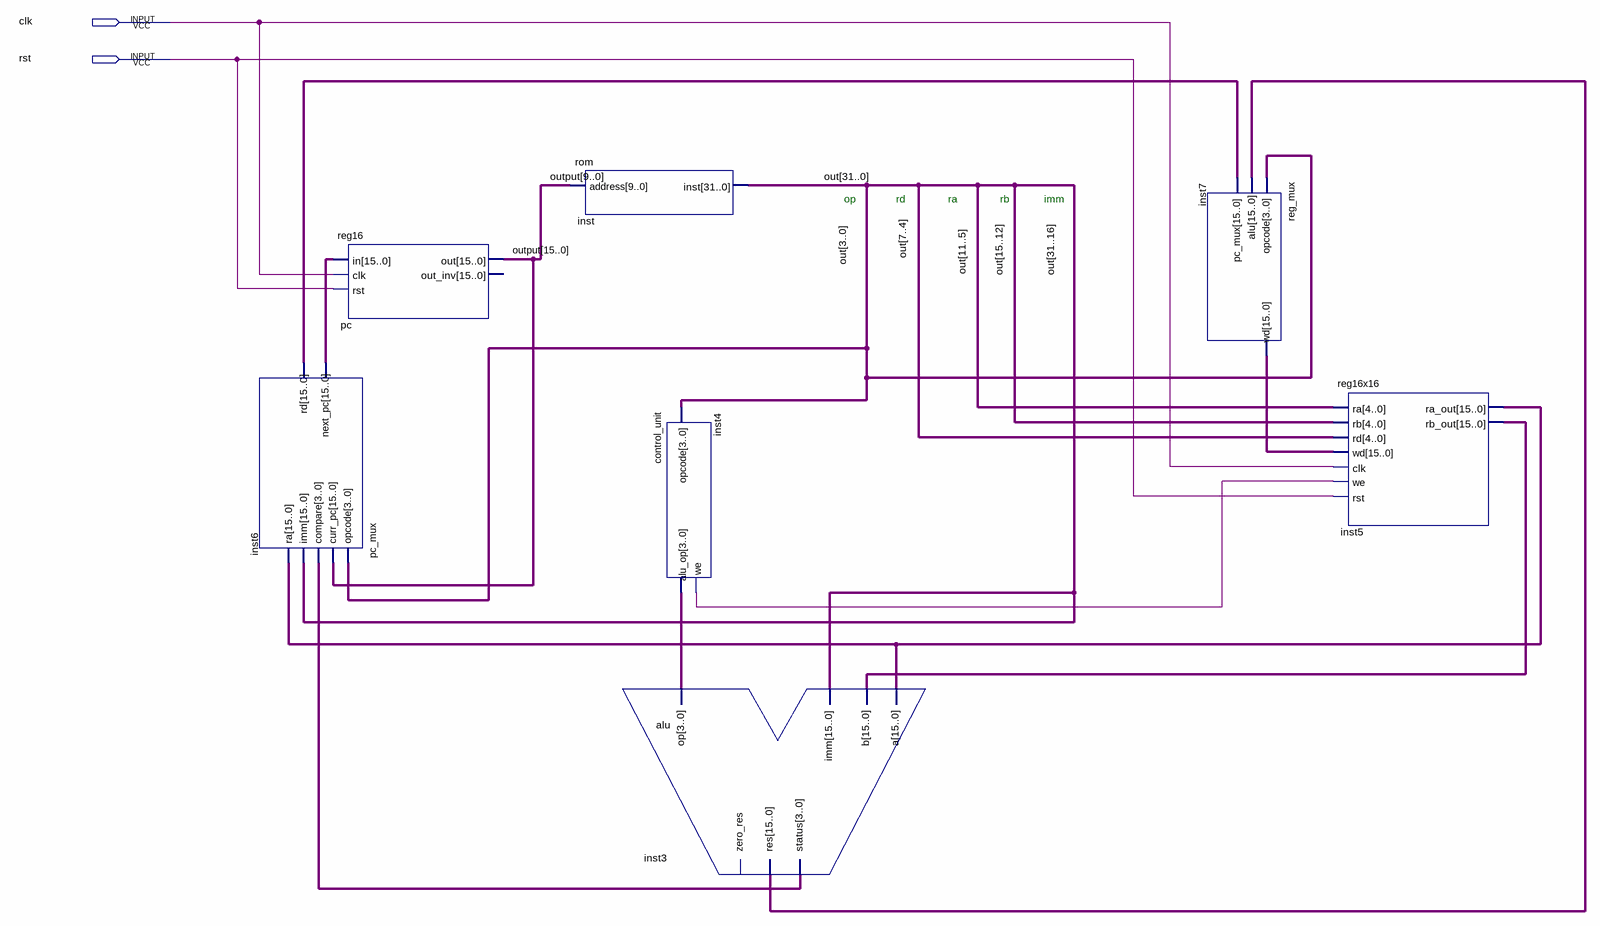
[diagram p0: schematic sheet]
// Quartus schematic zepto-processor-v.bdf as structural Verilog: 7 symbols, 2 pins
module \zepto-processor-v  (
  input  clk,
  input  rst
);

  wire inst4_we;
  wire [3:0] inst3_status, inst4_alu_op;
  wire [15:0] inst3_res, inst5_ra_out, inst5_rb_out, inst6_next_pc, inst6_rd, inst7_wd, \output ;
  wire [31:0] out;

  pc_mux inst6 (
    .opcode(out[3:0]), .curr_pc(\output ), .compare(inst3_status), .imm(out[31:16]), .ra(inst5_ra_out),
    .next_pc(inst6_next_pc), .rd(inst6_rd));
  reg16 pc (.in(inst6_next_pc), .clk(clk), .rst(rst), .out(\output ));  // open: out_inv
  rom inst (.address(\output [9:0]), .inst(out));
  control_unit inst4 (.opcode(out[3:0]), .alu_op(inst4_alu_op), .we(inst4_we));
  alu inst3 (
    .a(inst5_ra_out), .b(inst5_rb_out), .imm(out[31:16]), .op(inst4_alu_op), .res(inst3_res),
    .status(inst3_status));  // open: zero_res
  reg_mux inst7 (.opcode(out[3:0]), .alu(inst3_res), .pc_mux(inst6_rd), .wd(inst7_wd));
  reg16x16 inst5 (
    .ra(out[11:5]), .rb(out[15:12]), .rd(out[7:4]), .wd(inst7_wd), .clk(clk), .we(inst4_we), .rst(rst),
    .ra_out(inst5_ra_out), .rb_out(inst5_rb_out));

  // Notes on the sheet:
  //   op
  //   rd
  //   ra
  //   rb
  //   imm
endmodule
